# Altium schematic sheet USB & power.SchDoc
size A4; SheetNumber: 3; SheetTotal: 3
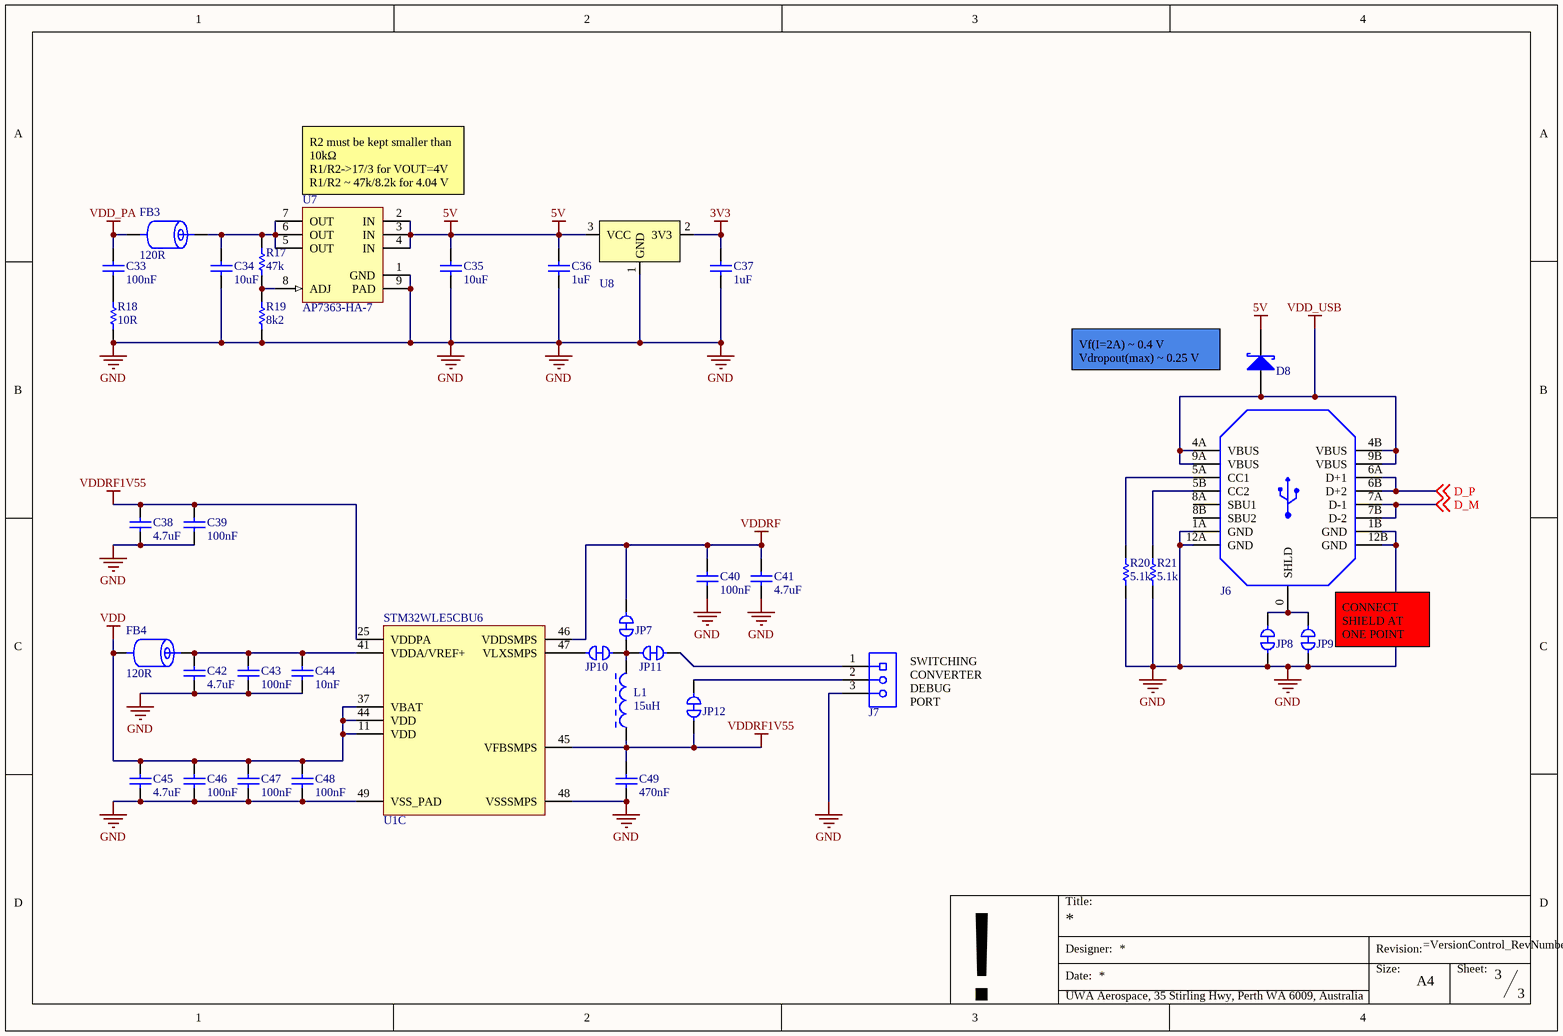
[diagram p0: USB & power.SchDoc]

## Parts
C33  value 100nF  [CAPC1608X10N]  (hidden comment: C0603C104M5RACTU)
C34  value 10uF  [CAPC2012X14N]  (hidden comment: C0805C106K8PACTU)
C35  value 10uF  [CAPC2012X14N]  (hidden comment: C0805C106K8PACTU)
C36  value 1uF  [CAPC1608X10N]  (hidden comment: C0603C105K4RACTU)
C37  value 1uF  [CAPC1608X10N]  (hidden comment: C0603C105K4RACTU)
C38  value 4.7uF  [CAPC1608X10N]  (hidden comment: C0603C475K9PACTU)
C39  value 100nF  [CAPC1608X10N]  (hidden comment: C0603C104M5RACTU)
C40  value 100nF  [CAPC1608X10N]  (hidden comment: C0603C104M5RACTU)
C41  value 4.7uF  [CAPC1608X10N]  (hidden comment: C0603C475K9PACTU)
C42  value 4.7uF  [CAPC1608X10N]  (hidden comment: C0603C475K9PACTU)
C43  value 100nF  [CAPC1608X10N]  (hidden comment: C0603C104M5RACTU)
C44  value 10nF  [CAPC1608X10N]  (hidden comment: C0603C103J5RACTU)
C45  value 4.7uF  [CAPC1608X10N]  (hidden comment: C0603C475K9PACTU)
C46  value 100nF  [CAPC1608X10N]  (hidden comment: C0603C104M5RACTU)
C47  value 100nF  [CAPC1608X10N]  (hidden comment: C0603C104M5RACTU)
C48  value 100nF  [CAPC1608X10N]  (hidden comment: C0603C104M5RACTU)
C49  value 470nF  [CAPC1608X10N]  (hidden comment: CL10B474KA8NNNC)
D8  SS54  [DIOM4226X20N]  (value not drawn)
FB3  value 120R  [INDC1608X10N]  (hidden comment: PE-0603PFB121ST)
FB4  value 120R  [INDC1608X10N]  (hidden comment: PE-0603PFB121ST)
J6  USB4105-GF-A  [GCT_USB4105-GF-A]  (value not drawn)
J7  10129378-903001BLF  [10129378-903001BLF-Footprint-1]  (value not drawn)
JP7  RC0603FR-070RL  [RESC1608X05N]  (value not drawn)
JP8  RC0603FR-070RL  [RESC1608X05N]  (value not drawn)
JP9  RC0603FR-070RL  [RESC1608X05N]  (value not drawn)
JP10  RC0603FR-070RL  [RESC1608X05N]  (value not drawn)
JP11  RC0603FR-070RL  [RESC1608X05N]  (value not drawn)
JP12  RC0603FR-070RL  [RESC1608X05N]  (value not drawn)
L1  value 15uH  [INDC2012X14N]  (hidden comment: MLZ2012M150WT000)
R17  value 47k  [RESC1608X05N]  (hidden comment: ERJ3EKF4702V)
R18  value 10R  [RESC1005X04N]  (hidden comment: ERJ-PA2J100X)
R19  value 8k2  [RESC1608X05N]  (hidden comment: CRCW06038K20JNEAC)
R20  value 5.1k  [RESC1608X06N]  (hidden comment: CRCW06035K10FKEA)
R21  value 5.1k  [RESC1608X06N]  (hidden comment: CRCW06035K10FKEA)
U1  STM32WLE5CBU6  [QFN50P700X700X60_HS-49L]  (part C of 3)
U7  AP7363-HA-7  [SON50P300X63_HS-9M]
U8  XC6206P332MR  [SOT95P280X120-3N]  (value not drawn)

## Nets
3V3: C37.2 U8.2(3V3)
5V: C35.2 C36.2 D8.2(K) U7.2(IN) U7.3(IN) U7.4(IN) U8.3(VCC)
GND: C34.1 C35.1 C36.1 C37.1 C38.1 C39.1 C40.1 C41.1 C42.1 C43.1 C44.1 C45.1 C46.1 C47.1 C48.1 C49.1 J6.1A(GND) J6.1B(GND) J6.12A(GND) J6.12B(GND) J7.3 JP8.1 JP9.1 R18.1 R19.2 R20.1 R21.2 U1.48(VSSSMPS) U1.49(VSS_PAD) U7.1(GND) U7.9(PAD) U8.1(GND)
VDD: C45.2 C46.2 C47.2 C48.2 FB4.2 U1.11(VDD) U1.37(VBAT) U1.44(VDD)
VDD_PA: C33.2 FB3.2
VDD_USB: D8.1(A) J6.4A(VBUS) J6.4B(VBUS) J6.9A(VBUS) J6.9B(VBUS)
VDDRF: C40.2 C41.2 JP7.2 U1.46(VDDSMPS)
VDDRF1V55: C38.2 C39.2 C49.2 JP12.2 L1.1 U1.25(VDDPA) U1.45(VFBSMPS)
D_M: J6.7A(D-1) J6.7B(D-2) ; off-sheet D_M
D_P: J6.6A(D+1) J6.6B(D+2) ; off-sheet D_P
NetC33_1: C33.1 R18.2
NetC34_2: C34.2 FB3.1 R17.2 U7.5(OUT) U7.6(OUT) U7.7(OUT)
NetC42_2: C42.2 C43.2 C44.2 FB4.1 U1.41(VDDA/VREF+)
NetJ6_0: J6.0(SHLD) JP8.2 JP9.2
NetJ6_5A: J6.5A(CC1) R20.2
NetJ6_5B: J6.5B(CC2) R21.1
NetJ7_1: J7.1 JP11.1
NetJ7_2: J7.2 JP12.1
NetJP7_1: JP7.1 JP10.2 JP11.2 L1.2
NetJP10_1: JP10.1 U1.47(VLXSMPS)
NetR17_1: R17.1 R19.1 U7.8(ADJ)

Not connected (* = marked no-connect by the designer): J6 8A(SBU1) 8B(SBU2)

## Notes on the sheet
- (near U7) R2 must be kept smaller than 10kΩ
  R1/R2->17/3 for VOUT=4V
  R1/R2 ~ 47k/8.2k for 4.04 V
- (near D8) Vf(I=2A) ~ 0.4 V
  Vdropout(max) ~ 0.25 V
- (near J6) CONNECT SHIELD AT ONE POINT ONLY
- (near J7) SWITCHING CONVERTER DEBUG PORT
- Title:
- Designer:
- Date:
- Size:
- Revision:
- A4
- Sheet:
- !
- UWA Aerospace, 35 Stirling Hwy, Perth WA 6009, Australia

## Library data of the parts
C33 C39 C40 C43 C46-C48 = CMP-00038-5: Cap Ceramic 0.1uF 50V X7R 20% SMD 0603 125C T/R; Dissipation Factor: 2.5%; Capacitance: 100nF; Contact Plating: Tin,Matte; Length: 1.6mm; Lead Pitch: 0.7mm; Thickness: 0.034inch; Max Operating Temperature: 125°C; Voltage Rating: 50V; Termination: SMD/SMT; Depth: 0.8mm; REACH SVHC: No SVHC; Radiation Hardening: No; Case Code (Metric): 1608; Mount: Surface Mount,PCB; Package Quantity: 1; Case Code (Imperial): 0603; Width: 0.031inch; JLC_PN: C14663; Min Operating Temperature: -55°C; Packaging: Tape and Reel; Case/Package: 0603; Tolerance: 20%; Dielectric Material: Ceramic; Height: 0.8mm; Dielectric: X7R; Voltage Rating (DC): 50V
C34 C35 = CMP-00046-3: CAP CER 10UF 10V X5R 0805; Dissipation Factor: 10%; Dielectric Material: Ceramic; Packaging: Tape and Reel; Termination: SMD/SMT; Max Operating Temperature: 85°C; REACH SVHC: No SVHC; Case Code (Imperial): 0805; Length: 2mm; Width: 1.2mm; Case Code (Metric): 2012; Number of Pins: 2; Voltage Rating (DC): 10V; Min Operating Temperature: -55°C; Height: 1.25mm; Case/Package: 0805; Voltage: 10V; Radiation Hardening: No; Contact Plating: Tin,Matte; JLC_PN: C15850; Mount: Surface Mount; Dielectric: X5R; Thickness: 0.055inch; Depth: 1.25mm; Capacitance: 10uF; Tolerance: 10%; Package Quantity: 1; Voltage Rating: 10V
C36 C37 = CMP-00161-2: KEMET - C0603C105K4RACTU - SMD Multilayer Ceramic Capacitor, 1 µF, 16 V, 0603 [1608 Metric], ± 10%, X7R, C Series KEMET; Dissipation Factor: 3.5%; Voltage Rating: 16V; Dielectric Material: Ceramic; Radiation Hardening: No; Case/Package: 0603; Contact Plating: Tin,Matte; REACH SVHC: No SVHC; Capacitance: 1uF; JLC_PN: C15849; Width: 0.031inch; Depth: 0.8mm; Package Quantity: 4000; Voltage: 16V; Packaging: Tape and Reel; Length: 1.6mm; Thickness: 0.034inch; Height: 0.8mm; Case Code (Metric): 1608; Tolerance: 10%; Max Operating Temperature: 125°C; Case Code (Imperial): 0603; Min Operating Temperature: -55°C; Dielectric: X7R; Mount: Surface Mount,PCB; Voltage Rating (DC): 16V; Number of Pins: 2; Termination: SMD/SMT
C38 C41 C42 C45 = CMP-00044-2: KEMET - C0603C475K9PACTU - SMD Multilayer Ceramic Capacitor, 4.7 µF, 6.3 V, 0603 [1608 Metric], ± 10%, X5R, C Series KEMET; Voltage: 6.3V; Dissipation Factor: 5%; Number of Pins: 2; Length: 1.6mm; Packaging: Tape and Reel; Case Code (Imperial): 0603; Radiation Hardening: No; Tolerance: 10%; Thickness: 0.035inch; Case Code (Metric): 1608; Max Operating Temperature: 85°C; JLC_PN: C19666; Dielectric: X5R; Min Operating Temperature: -55°C; Construction: Flat; Depth: 0.8mm; Contact Plating: Tin,Matte; Lead Free: Lead Free; Voltage Rating (DC): 6.3V; Voltage Rating: 6.3V; Dielectric Material: Ceramic; Material: Ceramic; Capacitance: 4.7uF; Series: CL; Lead Pitch: 0.7mm; Case/Package: 0603; Height: 0.8mm; Width: 0.031inch; Mounting Technology: Surface Mount; Termination: SMD/SMT; Package Quantity: 1; REACH SVHC: No SVHC; Mount: Surface Mount,PCB
C44 = CMP-00047-2: Cap Ceramic 0.01uF 50V X7R 5% SMD 0603 125C Paper T/R; Packaging: Tape and Reel; Min Operating Temperature: -55°C; Radiation Hardening: No; JLC_PN: C57112; Length: 1.6mm; Capacitance: 10nF; Depth: 0.8mm; Tolerance: 5%; Max Operating Temperature: 125°C; Case/Package: 0603; Height: 0.8mm; Dielectric: X7R; Mount: Surface Mount
C49 = CMP-00043-2: CAP CER 0.47UF 25V X7R 0603; Tolerance: 10%; RoHS Compliant: Yes; Dielectric: X7R; Lead Free: Lead Free; JLC_PN: C1623; Case Code (Metric): 1608; Width: 0.031inch; Series: CL; Case Code (Imperial): 0603; Packaging: Tape and Reel; Height: 0.8mm; Max Operating Temperature: 125°C; Min Operating Temperature: -55°C; Radiation Hardening: No; Case/Package: 0603; Voltage Rating: 25V; Voltage Rating (DC): 25V; Package Quantity: 1; Mounting Technology: Surface Mount; Length: 1.6mm; Construction: Flat; Depth: 0.8mm; Thickness: 0.035inch
D8 = CMP-00627-1: SCHOTTKY DIODE, 5A, 40V, SMC, FULL REEL; Diode Configuration:Single; Repetitive Reverse Voltage Vrrm Max:40V; Forward Current If(AV):5A; Diode Case Style:DO-214AB; No. of Pins:2Pins; Forward Voltage VF Max:550mV ;RoHS Compliant: Yes; Max Forward Surge Current (Ifsm): 150A; Forward Current: 5A; Max Operating Temperature: 125°C; Case/Package: SMC; Pins: 2; Packaging: Cut Tape; Reach SVHC Compliant: No; JLC_PN: C22452; Max Repetitive Reverse Voltage (Vrrm): 40V; Min Operating Temperature: -55°C
FB3 FB4 = CMP-00562-1: Ferrite Beads Multi-Layer High Current 120Ohm 25% 100MHz 2A 0.05Ohm DCR 0603 T/R; DC Resistance (DCR): 50mR; Number of Lines: 1; Max Current Rating: 2A; Packaging: Cut Tape; Height: 0.041inch; Case Code (Metric): 1608; Min Operating Temperature: -40°C; Case/Package: 0603; Series: PFB; Length: 0.063inch; Case Code (Imperial): 0603; Max Operating Temperature: 105°C; Mounting Technology: Surface Mount; Package Quantity: 4000; Width: 0.031inch
J6 = CMP-00616-2: Conn USB 2.0 Type C RCP 24 POS 0.3mm/0.5mm Solder RA SMD 24 Terminal 1 Port T/R; Mating Cycles: 10000; Shielding: Shielded; Number of Ports: 1; Gender: Receptacle; Mounting Technology: Surface Mount,Through Hole,Horizontal; Termination: Solder; Max Operating Temperature: 85°C; Connector Type: USB; Contact Plating: Gold; Series: USB4105; Min Operating Temperature: -40°C; Insulation Color: Black; Flammability Rating: UL94 V-0
J7 = CMP-00188-2: Conn Unshrouded Header HDR 3 POS 2.54mm Solder ST Thru-Hole Poly Bag
JP7-JP12 = CMP-00415-4: RC Series 0603 0.1 W 0 Ohm Jumper Surface Mount Thick Film Chip Resistor; Voltage Rating: 50V; Temperature Coefficient: 200ppm/°C; Max Power Dissipation: 100mW; Tolerance: 1%; Resistance: 0mR; Working Voltage: 75V; Current Rating: 1A; Radiation Hardening: No; Case Code (Metric): 1608; Military Standard: Not; Max Operating Temperature: 155°C; Power Rating: 100mW; Features: Moisture Resistant; Length: 1.6mm; RoHS Compliant: Yes; Series: RC; Termination: SMD/SMT; Package Quantity: 5000; REACH SVHC: No SVHC; Contact Plating: Tin,Matte; Height: 0.45mm; Resistor Type: Thick Film; Construction: Rectangular; Case Code (Imperial): 0603; Case/Package: 0603; JLC_PN: C21189; Technology: THICK FILM; Packaging: Tape and Reel; Voltage Rating (DC): 50V; Depth: 0.8mm; Number of Terminations: 2; Lead Free: Lead Free; Resistance Tolerance: 1%; Number of Pins: 2; Width: 0.8mm; Min Operating Temperature: -55°C
L1 = CMP-00609-1: Inductor Power Shielded Multi-Layer 15uH 20% 2MHz Ferrite 0.25A 1.235Ohm DCR 0805 T/R; DC Resistance (DCR): 950mR; Saturation Current: 120mA; Self Resonant Frequency: 40MHz; Max Operating Temperature: 125°C; Case Code (Metric): 2012; Min Operating Temperature: -55°C; Shielding: Shielded; Tolerance: 20%; RoHS Compliant: Yes; Core Material: Ferrite; Series: MLZ; Case/Package: 0805; Case Code (Imperial): 0805; Packaging: Cut Tape; Mounting Technology: Surface Mount; Test Frequency: 2MHz
R17 = CMP-00343-3: Res Thick Film 0603 47K Ohm 1% 1/10W ±100ppm/°C Molded SMD Punched Carrier T/R; Working Voltage: 6V; Voltage Rating (DC): 75V; Max Power Dissipation: 100mW; Case Code (Metric): 1608; Max Operating Temperature: 155°C; Length: 1.6mm; Technology: THICK FILM; Contact Plating: Tin; Tolerance: 1%; Case Code (Imperial): 0603; Military Standard: Not; REACH SVHC: No SVHC; Resistance Tolerance: 1%; Number of Terminations: 2; Packaging: Tape and Reel; Number of Pins: 2; Height: 0.45mm; Termination: SMD/SMT; Features: Automotive AEC-Q200; Min Operating Temperature: -55°C; Series: ERJ; Temperature Coefficient: 100ppm/°C; Voltage Rating: 75V; Case/Package: 0603; Package Quantity: 5000; Depth: 0.8mm; JLC_PN: C25819; Construction: Rectangular; Radiation Hardening: No; Power Rating: 100mW; Width: 0.8mm; Lead Free: Lead Free; RoHS Compliant: Yes; Mount: Surface Mount; Resistor Type: Thick Film
R18 = CMP-00498-3: Res Thick Film 0402 10 Ohm 5% 1/5W ±200ppm/°C Molded SMD Punched Paper T/R; Max Power Dissipation: 200mW; Max Operating Temperature: 155°C; Case/Package: 0402; JLC_PN: C25077; Features: Automotive AEC-Q200; Height: 0.016inch; Width: 0.02inch; Packaging: Cut Tape; Temperature Coefficient: 200ppm/°C; Length: 0.039inch; Tolerance: 5%; Case Code (Metric): 1005; Number of Terminations: 2; Resistance: 10R; Resistor Type: Thick Film; Case Code (Imperial): 0402; Min Operating Temperature: -55°C; Series: ERJ
R19 = CMP-00405-2: Res Thick Film 0603 8.2K Ohm 5% 1/10W ±200ppm/°C Molded SMD Paper T/R; Power Rating: 100mW; Resistance: 8.2kR; Lead Free: Lead Free; RoHS Compliant: Yes; Tolerance: 5%; Case/Package: 0603; JLC_PN: C25981
R20 R21 = CMP-00220-2: Res Thick Film 0603 5.1K Ohm 1% 1/10W ±100ppm/°C Molded SMD SMD Paper T/R; Power Rating: 100mW; Voltage Rating (DC): 75V; Case/Package: 0603; Max Operating Temperature: 155°C; Features: Automotive AEC-Q200; Height: 0.45mm; Series: CRCW; JLC_PN: C23186; Max Power Dissipation: 100mW; Radiation Hardening: No; Depth: 0.85mm; Technology: THICK FILM; Reach SVHC Compliant: Unknown; Package Quantity: 5000; Contact Plating: Tin; Case Code (Metric): 1608; Lead Free: Lead Free; Military Standard: Not; Tolerance: 1%; Resistor Type: Thick Film; Weight: 7.1E-05oz; Resistance Tolerance: 1%; Temperature Coefficient: 100ppm/°C; Termination: SMD/SMT; Min Operating Temperature: -55°C; Construction: Rectangular; RoHS Compliant: Yes; Packaging: Tape and Reel; Number of Terminations: 2; Width: 0.85mm; Voltage Rating: 75V; Case Code (Imperial): 0603; Length: 1.55mm
U1 = CMP-00608-3: Microcontroller 32-Bit Arm Cortex-M4 RISC 128Kbyte 1.8V to 3.6V 48-Pin UFQFPN Industrial; Core:: ARM Cortex M4; Number of I/Os:: 43 I/O; Tradename:: STM32; Program Memory Size:: 128 kB; ADC Resolution:: 12 bit; Data Bus Width:: 32 bit; Package / Case:: UFQFPN-48; Product Category:: RF Microcontrollers - MCU; Mounting Style:: SMD/SMT; Brand:: STMicroelectronics; Interface Type:: I2C; Packaging:: Tray; Subcategory:: Wireless & RF Integrated Circuits; Data RAM Type:: RAM; Technology:: Si; Data RAM Size:: 64 kB; Maximum Clock Frequency:: 48 MHz; Program Memory Type:: Flash; Supply Voltage - Max:: 3.6 V; Series:: STM32WL; Minimum Operating Temperature:: - 40 C; Operating Supply Voltage:: 1.8 V to 3.6 V; Product Type:: RF Microcontrollers - MCU; Maximum Operating Temperature:: + 105 C; Supply Voltage - Min:: 1.8 V; Manufacturer:: STMicroelectronics; Moisture Sensitive:: Yes
U7 = CMP-00619-1: LDO Regulator Pos 0.6V to 5V 1.5A 8-Pin U-DFN2030 T/R; Polarity: Positive; Max Supply Voltage: 5.5V; Min Output Voltage: 600mV; Power Supply Rejection Ratio (PSRR): 61dB; Number of Regulators: 1; Output Type: Adjustable; Accuracy: 1.5%; Dropout Voltage: 190mV; Min Input Voltage: 2.2V; Quiescent Current: 1.2mA; Min Operating Temperature: -40°C; Output Configuration: Positive; Radiation Hardening: No; RoHS Compliant: Yes; Output Current: 1.5A; Weight: 0.139332oz; Series: -; Output Voltage: 5V; Max Output Voltage: 5V; Number of Outputs: 1; Max Operating Temperature: 85°C; Package Quantity: 3000; Pins: 8; Max Output current: 1.5A; Case/Package: TO-252-3; Mounting Technology: Surface Mount; Reach SVHC Compliant: No; Packaging: Tape and Reel
U8 = CMP-00487-2: IC REG LINEAR 3.3V 200MA SOT23; Output Type: Fixed; Max Input Voltage: 6V; Min Input Voltage: 1.8V; Dropout Voltage: 250mV; JLC_PN: C5446; ComponentLink1Description: Datasheet; ComponentLink1URL: https://datasheet.lcsc.com/lcsc/1809201513_Torex-Semicon-XC6206P332MR_C5446.pdf; Number of Pins: 3; Case/Package: SOT-23; Packaging: Cut Tape; Max Operating Temperature: 85°C; Min Operating Temperature: -40°C; RoHS Compliant: Yes; Nominal Output Voltage: 3.3V; REACH SVHC: No SVHC; Output Current: 200mA